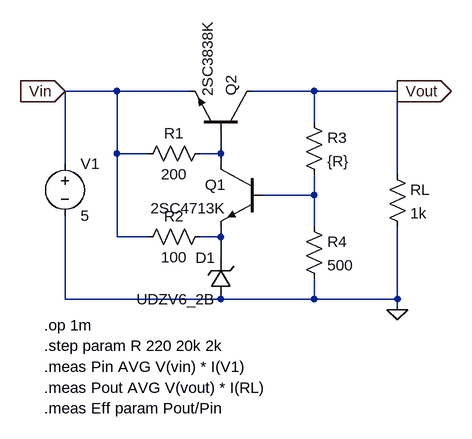
[diagram p0: schematic Draft1.asc]
Draft1.asc, the LTspice schematic file:
Version 4
SHEET 1 880 680
WIRE 64 16 -16 16
WIRE 176 16 64 16
WIRE 368 16 272 16
WIRE 496 16 368 16
WIRE 368 64 368 16
WIRE 64 112 64 16
WIRE 112 112 64 112
WIRE 224 112 224 80
WIRE 224 112 192 112
WIRE -16 128 -16 16
WIRE 224 128 224 112
WIRE 496 144 496 16
WIRE 368 176 368 144
WIRE 368 176 288 176
WIRE 368 224 368 176
WIRE 64 240 64 112
WIRE 112 240 64 240
WIRE 224 240 224 224
WIRE 224 240 192 240
WIRE 224 272 224 240
WIRE -16 336 -16 208
WIRE 224 336 -16 336
WIRE 368 336 368 304
WIRE 368 336 224 336
WIRE 496 336 496 224
WIRE 496 336 368 336
WIRE 496 352 496 336
FLAG 496 352 0
FLAG -16 16 Vin
IOPIN -16 16 In
FLAG 496 16 Vout
IOPIN 496 16 Out
SYMBOL res 208 96 R90
WINDOW 0 0 56 VBottom 2
WINDOW 3 32 56 VTop 2
SYMATTR InstName R1
SYMATTR Value 200
SYMBOL res 208 224 R90
WINDOW 0 0 56 VBottom 2
WINDOW 3 32 56 VTop 2
SYMATTR InstName R2
SYMATTR Value 100
SYMBOL res 352 48 R0
SYMATTR InstName R3
SYMATTR Value {R}
SYMBOL res 352 208 R0
SYMATTR InstName R4
SYMATTR Value 500
SYMBOL res 480 128 R0
SYMATTR InstName RL
SYMATTR Value 1k
SYMBOL voltage -16 112 R0
WINDOW 123 0 0 Left 0
WINDOW 39 0 0 Left 0
SYMATTR InstName V1
SYMATTR Value 5
SYMBOL zener 240 336 R180
WINDOW 0 24 64 Left 2
WINDOW 3 24 0 Left 2
SYMATTR InstName D1
SYMATTR Value UDZV6_2B
SYMBOL npn 288 128 M0
SYMATTR InstName Q1
SYMATTR Value 2SC4713K
SYMBOL npn 272 80 M270
SYMATTR InstName Q2
SYMATTR Value 2SC3838K
TEXT -48 376 Left 2 !.op 1m
TEXT -48 408 Left 2 !.step param R 220 20k 2k
TEXT -48 440 Left 2 !.meas Pin AVG V(vin) * I(V1)
TEXT -48 472 Left 2 !.meas Pout AVG V(vout) * I(RL)
TEXT -48 504 Left 2 !.meas Eff param Pout/Pin

The netlist it stands for:
* Draft1.asc
R1 N001 Vin 200
R2 N003 Vin 100
R3 Vout N002 {R}
R4 N002 0 500
RL Vout 0 1k
V1 Vin 0 5
D1 0 N003 UDZV6_2B
Q1 N001 N002 N003 0 2SC4713K
Q2 Vout N001 Vin 0 2SC3838K
.model D D
.lib standard.dio
.model NPN NPN
.model PNP PNP
.lib standard.bjt
.op 1m
.step param R 220 20k 2k
.meas Pin AVG V(vin) * I(V1)
.meas Pout AVG V(vout) * I(RL)
.meas Eff param Pout/Pin
.backanno
.end